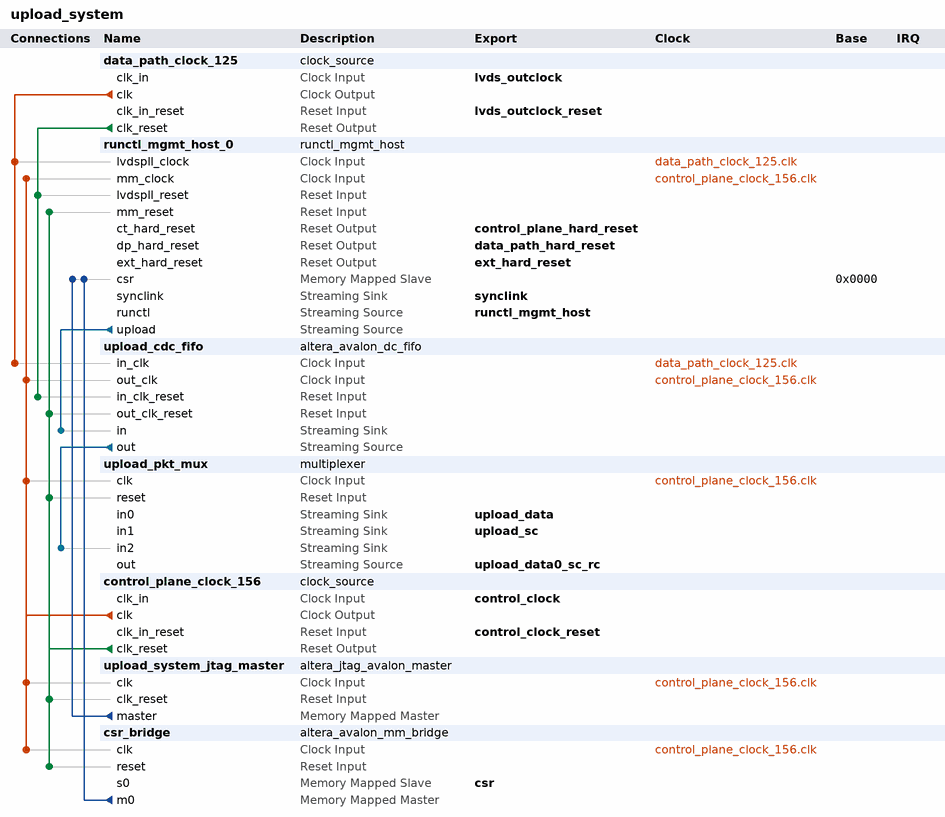
[diagram p0: system contents]
# Platform Designer (Qsys) system upload_system, Arria V 5AGXBA7D4F31C5
# Parameters at their usual value, and those the tool derives, are not listed.
package require -exact qsys 18.1
create_system upload_system
set_project_property DEVICE_FAMILY {Arria V}
set_project_property DEVICE 5AGXBA7D4F31C5

add_instance data_path_clock_125 clock_source 18.1
set_instance_parameter_value data_path_clock_125 clockFrequency 125000000
set_instance_parameter_value data_path_clock_125 resetSynchronousEdges BOTH

add_instance runctl_mgmt_host_0 runctl_mgmt_host 26.2.0.0416
set_instance_parameter_value runctl_mgmt_host_0 DEBUG 1
set_instance_parameter_value runctl_mgmt_host_0 RUN_END_ACK_SYMBOL 0xFD
set_instance_parameter_value runctl_mgmt_host_0 RUN_START_ACK_SYMBOL 0xFE

add_instance upload_cdc_fifo altera_avalon_dc_fifo 18.1
set_instance_parameter_value upload_cdc_fifo BITS_PER_SYMBOL 36
set_instance_parameter_value upload_cdc_fifo FIFO_DEPTH 16
set_instance_parameter_value upload_cdc_fifo RD_SYNC_DEPTH 2
set_instance_parameter_value upload_cdc_fifo USE_PACKETS 1
set_instance_parameter_value upload_cdc_fifo WR_SYNC_DEPTH 2

add_instance upload_pkt_mux multiplexer 18.1
set_instance_parameter_value upload_pkt_mux bitsPerSymbol 36
set_instance_parameter_value upload_pkt_mux errorWidth 0
set_instance_parameter_value upload_pkt_mux numInputInterfaces 3
set_instance_parameter_value upload_pkt_mux outChannelWidth 2
set_instance_parameter_value upload_pkt_mux packetScheduling true
set_instance_parameter_value upload_pkt_mux schedulingSize 2
set_instance_parameter_value upload_pkt_mux symbolsPerBeat 1
set_instance_parameter_value upload_pkt_mux useHighBitsOfChannel true
set_instance_parameter_value upload_pkt_mux usePackets true

add_instance control_plane_clock_156 clock_source 18.1
set_instance_parameter_value control_plane_clock_156 clockFrequency 156250000
set_instance_parameter_value control_plane_clock_156 resetSynchronousEdges BOTH

add_instance upload_system_jtag_master altera_jtag_avalon_master 18.1

add_instance csr_bridge altera_avalon_mm_bridge 18.1
set_instance_parameter_value csr_bridge ADDRESS_UNITS WORDS
set_instance_parameter_value csr_bridge ADDRESS_WIDTH 5
set_instance_parameter_value csr_bridge DATA_WIDTH 32
set_instance_parameter_value csr_bridge MAX_PENDING_RESPONSES 1
set_instance_parameter_value csr_bridge PIPELINE_COMMAND 0
set_instance_parameter_value csr_bridge PIPELINE_RESPONSE 0
set_instance_parameter_value csr_bridge USE_AUTO_ADDRESS_WIDTH 0
set_instance_parameter_value csr_bridge USE_RESPONSE 1

# connections
add_connection control_plane_clock_156.clk csr_bridge.clk clock
add_connection control_plane_clock_156.clk runctl_mgmt_host_0.mm_clock clock
add_connection control_plane_clock_156.clk upload_cdc_fifo.out_clk clock
add_connection control_plane_clock_156.clk upload_pkt_mux.clk clock
add_connection control_plane_clock_156.clk upload_system_jtag_master.clk clock
add_connection data_path_clock_125.clk runctl_mgmt_host_0.lvdspll_clock clock
add_connection data_path_clock_125.clk upload_cdc_fifo.in_clk clock
add_connection control_plane_clock_156.clk_reset csr_bridge.reset reset
add_connection control_plane_clock_156.clk_reset runctl_mgmt_host_0.mm_reset reset
add_connection control_plane_clock_156.clk_reset upload_cdc_fifo.out_clk_reset reset
add_connection control_plane_clock_156.clk_reset upload_pkt_mux.reset reset
add_connection control_plane_clock_156.clk_reset upload_system_jtag_master.clk_reset reset
add_connection data_path_clock_125.clk_reset runctl_mgmt_host_0.lvdspll_reset reset
add_connection data_path_clock_125.clk_reset upload_cdc_fifo.in_clk_reset reset
add_connection csr_bridge.m0 runctl_mgmt_host_0.csr avalon
set_connection_parameter_value csr_bridge.m0/runctl_mgmt_host_0.csr baseAddress 0x0000
add_connection upload_system_jtag_master.master runctl_mgmt_host_0.csr avalon
set_connection_parameter_value upload_system_jtag_master.master/runctl_mgmt_host_0.csr baseAddress 0x0000
add_connection runctl_mgmt_host_0.upload upload_cdc_fifo.in avalon_streaming
add_connection upload_cdc_fifo.out upload_pkt_mux.in2 avalon_streaming

# exported interfaces
add_interface control_clock clock sink
set_interface_property control_clock EXPORT_OF control_plane_clock_156.clk_in
add_interface control_clock_reset reset sink
set_interface_property control_clock_reset EXPORT_OF control_plane_clock_156.clk_in_reset
add_interface control_plane_hard_reset reset source
set_interface_property control_plane_hard_reset EXPORT_OF runctl_mgmt_host_0.ct_hard_reset
add_interface data_path_hard_reset reset source
set_interface_property data_path_hard_reset EXPORT_OF runctl_mgmt_host_0.dp_hard_reset
add_interface ext_hard_reset reset source
set_interface_property ext_hard_reset EXPORT_OF runctl_mgmt_host_0.ext_hard_reset
add_interface lvds_outclock clock sink
set_interface_property lvds_outclock EXPORT_OF data_path_clock_125.clk_in
add_interface lvds_outclock_reset reset sink
set_interface_property lvds_outclock_reset EXPORT_OF data_path_clock_125.clk_in_reset
add_interface csr avalon slave
set_interface_property csr EXPORT_OF csr_bridge.s0
add_interface runctl_mgmt_host avalon_streaming source
set_interface_property runctl_mgmt_host EXPORT_OF runctl_mgmt_host_0.runctl
add_interface synclink avalon_streaming sink
set_interface_property synclink EXPORT_OF runctl_mgmt_host_0.synclink
add_interface upload_data avalon_streaming sink
set_interface_property upload_data EXPORT_OF upload_pkt_mux.in0
add_interface upload_data0_sc_rc avalon_streaming source
set_interface_property upload_data0_sc_rc EXPORT_OF upload_pkt_mux.out
add_interface upload_sc avalon_streaming sink
set_interface_property upload_sc EXPORT_OF upload_pkt_mux.in1

set_interconnect_requirement {$system} qsys_mm.clockCrossingAdapter HANDSHAKE
set_interconnect_requirement {$system} qsys_mm.enableEccProtection FALSE
set_interconnect_requirement {$system} qsys_mm.insertDefaultSlave FALSE
set_interconnect_requirement {$system} qsys_mm.maxAdditionalLatency 1

save_system upload_system.qsys
